# EasyEDA schematic SCH_MSP430G2553-protoboard.json
TITLE: MSP430 Proto Board; REV: 4.0; Date: 2021-03-15; Sheet: 1/1; Drawn By: Richard Spagnola; Company: Your Company
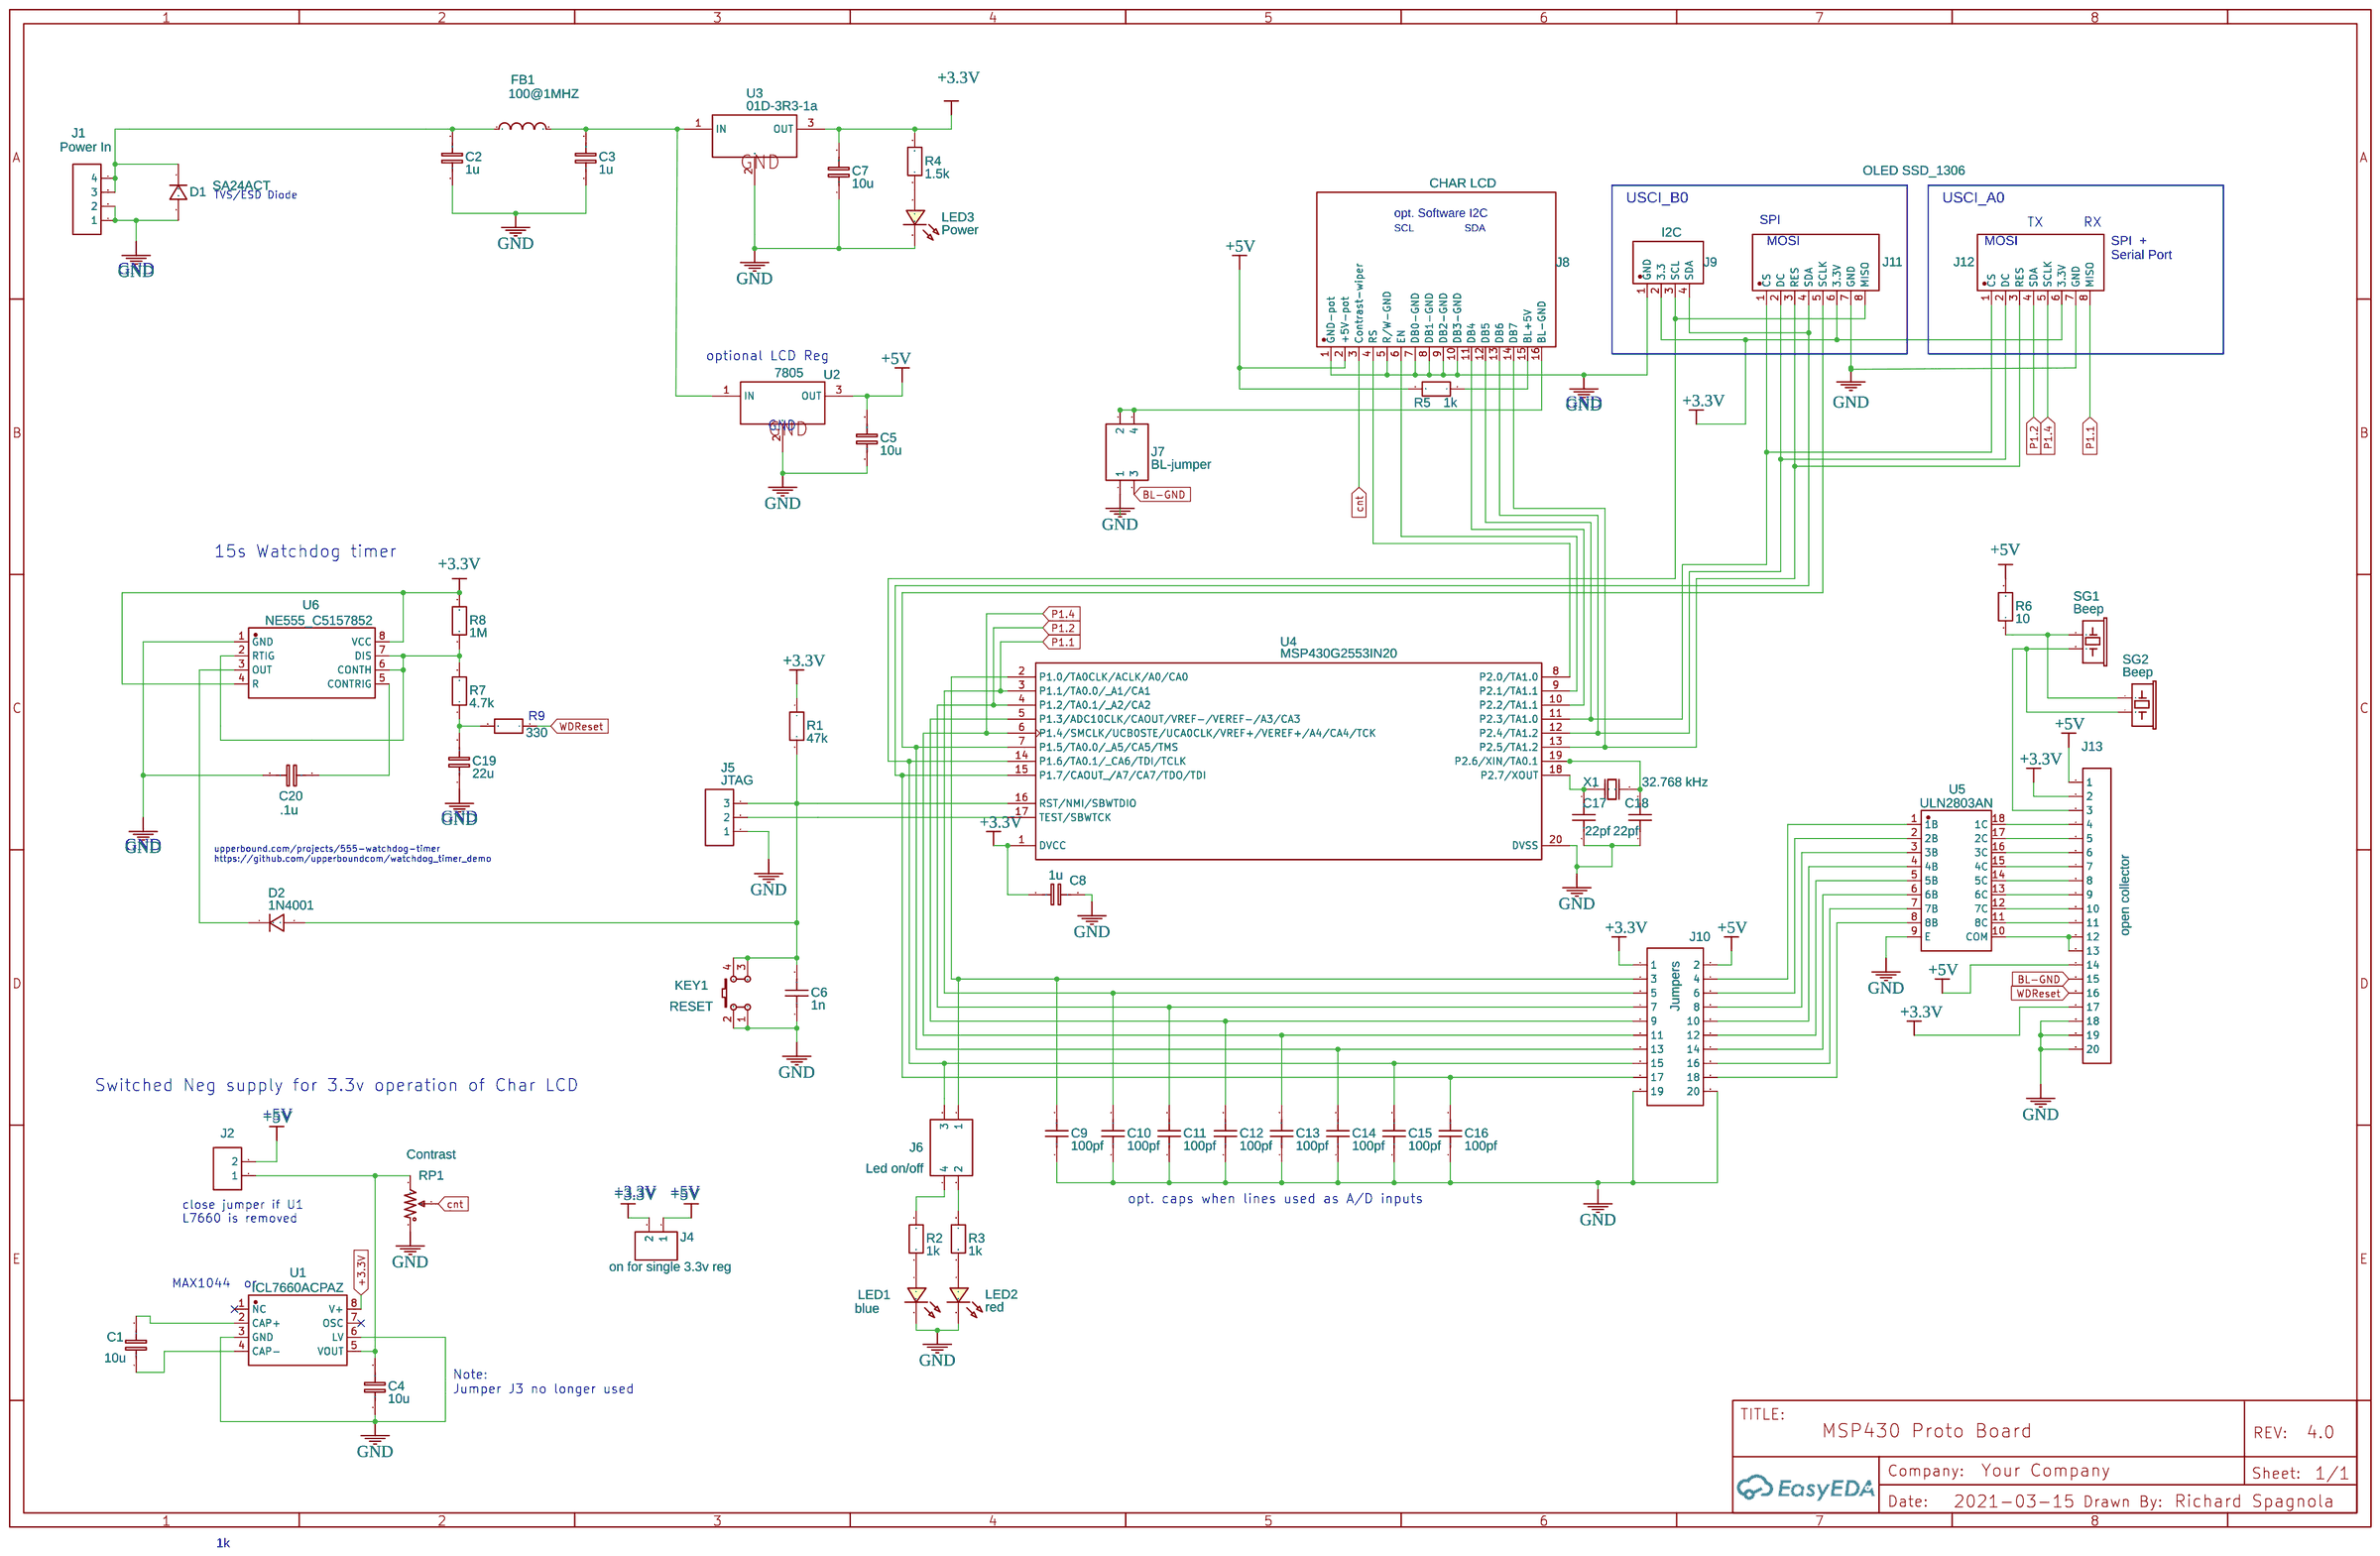
[diagram p0: schematic sheet]

## Parts
C1  10u  [RAD-0.2]
C2  1u  [RAD-0.2]
C3  1u  [RAD-0.2]
C4  10u  [RAD-0.2]
C5  10u  [RAD-0.2]
C6  1n  [RAD-0.1]
C7  10u  [RAD-0.2]
C8  1u  [RAD-0.2]
C9  100pf  [RAD-0.1]
C10  100pf  [RAD-0.1]
C11  100pf  [RAD-0.1]
C12  100pf  [RAD-0.1]
C13  100pf  [RAD-0.1]
C14  100pf  [RAD-0.1]
C15  100pf  [RAD-0.1]
C16  100pf  [RAD-0.1]
C17  22pf  [RAD-0.1]
C18  22pf  [RAD-0.1]
C19  22u  [RAD-0.2]
C20  .1u  [RAD-0.2]
D1  SA24ACT  [DO-41_BD2.4-L4.7-P8.70-D0.9-RD]
D2  1N4001  [DO-41_BD2.4-L4.7-P8.70-D0.9-RD]
FB1  100@1MHZ  [BEAD-TH_MLB6-10-3T-F]
J1  Power In  [HDR-M-2.54_1X4]
J2  HDR-M-2.54_1x2  [HDR-M-2.54_1X2]
J4  on for single 3.3v reg  [HDR-M-2.54_1X2]
J5  JTAG  [HDR-M-2.54_1X3]
J6  Led on/off  [HDR-M-2.54_2X2]
J7  BL-jumper  [HDR-M-2.54_2X2]
J8  CHAR LCD  [HDR-M-2.54_1X16]
J9  I2C  [HDR-M-2.54_1X4]
J10  Jumpers  [HDR-M-2.54_2X10]
J11  OLED SSD_1306  [HDR-M-2.54_1X8]
J12  OLED SSD_1306  [HDR-M-2.54_1X8]
J13  open collector  [HDR-M-2.54_1X20]
KEY1  RESET  [KEY-TH_4P-L6.0-W6.0-P4.50-LS6.5]
LED1  blue  [LED-TH_BD3.0_BLUE]
LED2  red  [LED-TH_BD3.0_RED]
LED3  Power  [LED-TH_BD3.0_GREEN]
R1  47k  [R_AXIAL-0.4]
R2  1k  [R_AXIAL-0.4]
R3  1k  [R_AXIAL-0.4]
R4  1.5k  [R_AXIAL-0.4]
R5  1k  [R_AXIAL-0.4]
R6  10  [R_AXIAL-0.4]
R7  4.7k  [R_AXIAL-0.4]
R8  1M  [R_AXIAL-0.4]
R10  330  [R_AXIAL-0.4]
RP1  Contrast  [RES-ADJ-TH_3386P]
SG1  Beep  [BEEP-TH_BD16.0-P5.00-D0.6-L-FD]
SG2  Beep  [BUZZER-12MM]
U1  ICL7660ACPAZ  [PDIP-8_L9.6-W6.4-P2.54-LS7.6-BL]
U2  7805  [TO-220-3_L10.0-W4.5-P2.54-L]
U3  01D-3R3-1a  [TO-220-3_L10.0-W4.5-P2.54-L]
U4  MSP430G2553IN20  [DIP-20_L25.5-W10.0-P2.54-LS7.6-BL]
U5  ULN2803AN  [DIP-18_L23.0-W6.5-P2.54-LS7.6-BL]
U6  NE555_C5157852  [DIP-8_L9.8-W6.4-P2.54-LS7.6-BL]
X1  32.768 kHz  [HC-49US_L11.5-W4.5-P4.88]

## Library data of the parts
C1-C5 C7 C8 C19 C20 = C_RAD-0.2_EU: Contributor: LCEDA_Lib
C6 C9-C18 = C_RAD-0.1_US: Contributor: LCEDA_Lib; Package Display: No
D1 D2 = 1N4007: Supplier: LCSC; Manufacturer: SEMTECH; Supplier Part: C106903; Contributor: LCEDA_Lib
FB1 = 6Hole beads6*10-3T: Supplier: LCSC; Manufacturer: Meled(美莱); Manufacturer Part: MLB6*10-3T(f); Supplier Part: C59501; JLCPCB Part Class: Extended Part; Package Display: No
J1 = HDR-M-2.54_1x4: Supplier Part: C124378; Supplier: LCSC; Contributor: LCEDA_Lib; Package Display: No
J2 J4 = HDR-M-2.54_1x2: Supplier Part: C124375; Supplier: LCSC; Contributor: LCEDA_Lib
J5 = HDR-M-2.54_1x3: Supplier Part: C180248; Supplier: LCSC; Contributor: LCEDA_Lib; Package Display: No
J6 J7 = HDR-M-2.54_2x2: Supplier Part: C66690; Supplier: LCSC; Contributor: LCEDA_Lib
J8 = LCD: Package Display: No
J9 = I2C: Package Display: No
J10 = HDR-M-2.54_2x10: Supplier Part: C124359; Supplier: LCSC; Contributor: LCEDA_Lib; Package Display: No
J11 J12 = SSD_1306: Package Display: No
J13 = HDR-M-2.54_1x20: Supplier Part: C50981; Supplier: LCSC; Contributor: LCEDA_Lib; Package Display: No
KEY1 = K4-6×6_TH: Supplier: LCSC; Supplier Part: C136684; Manufacturer: 韩国韩荣; Manufacturer Part: K2-1102DP-E4SW-04; Contributor: LCEDA_Lib; Package Display: No
LED1 = LED-TH-5mm_B: Supplier: LCSC; Contributor: LCEDA_Lib; Package Display: No
LED2 = LED-TH-5mm_R: Manufacturer: EVERLIGHT(台湾亿光); Manufacturer Part: 333-2SURD/S530-A3; Supplier Part: C87271; Supplier: LCSC; Contributor: LCEDA_Lib; Package Display: No
LED3 = LED-TH-5mm_G: Manufacturer: EVERLIGHT(台湾亿光); Manufacturer Part: 333-2SYGD/S530-E2; Supplier Part: C88163; Supplier: LCSC; Contributor: LCEDA_Lib; Package Display: No
R1 = R_AXIAL-0.3_EU: Contributor: LCEDA_Lib; Package Display: No
R2 R3 R5-R8 R10 = R_AXIAL-0.4_EU: Contributor: LCEDA_Lib; Package Display: No
R4 = R_AXIAL-0.5_EU: Contributor: LCEDA_Lib; Package Display: No
RP1 = R_3386P_US: Supplier: LCSC; Contributor: LCEDA_Lib; value(Ω): 5K; Package Display: No
SG1 SG2 = BUZZER: Contributor: SparkFun; Package Display: No
U1 = ICL7660ACPAZ: Supplier: LCSC; Supplier Part: C1356059; Manufacturer: RENESAS(瑞萨)/IDT; Contributor: LCSC
U2 U3 = 7805(TO-220): Supplier: LCSC; Manufacturer: STMicroelectronics; Manufacturer Part: L7805CV-DG; Supplier Part: C3795; Contributor: LCEDA_Lib; Package Display: No
U4 = MSP430G2553IN20: Supplier: LCSC; Supplier Part: C201660; Manufacturer: Texas Instruments; Contributor: LCSC; LCSC Assembly: Yes; SMT Type: Extend
U5 = ULN2803AN: Supplier: LCSC; Supplier Part: C481685; Manufacturer: HTC Korea TAEJIN Tech; Contributor: LCSC
U6 = NE555_C5157852: Supplier: LCSC; Supplier Part: C5157852; Manufacturer: Gcore(扬州国芯); Manufacturer Part: NE555; Contributor: lcsc
X1 = ESA16.0000F12M25F: Supplier: LCSC; Supplier Part: C353692; Manufacturer: ZHUHAI MONEC ELEC; Contributor: LCSC; LCSC Assembly: Yes; SMT Type: Extend; Assembly Type: manualWeld; Paste Type: expand

## Nets
+3.3V: C7.2 C8.1 J4.2 J9.2(3.3) J10.1 J11.6(3.3V) J12.6(3.3V) J13.2 J13.17 R1.1 R4.2 R8.2 U1.8(V+) U3.3(OUT) U4.1(DVCC) U6.4(R) U6.8(VCC)
+5V: C5.2 J2.2 J4.1 J8.2(+5V-pot) J10.2 J13.1 J13.14 R5.2 R6.2 U2.3(OUT)
GND: C2.1 C3.1 C4.1 C5.1 C6.1 C7.1 C8.2 C9.1 C10.1 C11.1 C12.1 C13.1 C14.1 C15.1 C16.1 C17.2 C18.1 C19.1 C20.2 D1.2 J1.1 J1.2 J5.1 J7.1 J8.1(GND-pot) J8.5(R/W-GND) J8.7(DB0-GND) J8.8(DB1-GND) J8.9(DB2-GND) J8.10(DB3-GND) J9.1(GND) J10.19 J10.20 J11.7(GND) J12.7(GND) J13.18 J13.19 J13.20 KEY1.1 KEY1.2 LED1.2 LED2.2 LED3.2 RP1.1 U1.3(GND) U1.6(LV) U2.2(GND) U3.2(GND) U4.20(DVSS) U5.9(E) U6.1(GND)
BL-GND: J7.3 J13.15
cnt: J8.3(Contrast-wiper) RP1.2
P1.1: C10.2 J10.5 J12.8(MISO) U4.3(P1.1/TA0.0/ A1/CA1)
P1.2: C11.2 J10.7 J12.4(SDA) U4.4(P1.2/TA0.1/ A2/CA2)
P1.4: C13.2 J10.11 J12.5(SCLK) U4.6(P1.4/SMCLK/UCB0STE/UCA0CLK/VREF+/VEREF+/A4/CA4/TCK)
WDReset: J13.16 R10.1
Net-(C1-1): C1.1 U1.4(CAP-)
Net-(C1-2): C1.2 U1.2(CAP+)
Net-(C2-2): C2.2 D1.1 FB1.1 J1.3 J1.4
Net-(C3-2): C3.2 FB1.2 U2.1(IN) U3.1(IN)
Net-(C4-2): C4.2 J2.1 RP1.3 U1.5(VOUT)
Net-(C6-2): C6.2 D2.2 J5.3 KEY1.3 KEY1.4 R1.2 U4.16(RST/NMI/SBWTDIO)
Net-(C9-2): C9.2 J6.1 J10.3 U4.2(P1.0/TA0CLK/ACLK/A0/CA0)
Net-(C12-2): C12.2 J10.9 U4.5(P1.3/ADC10CLK/CAOUT/VREF-/VEREF-/A3/CA3)
Net-(C14-2): C14.2 J10.13 J11.5(SCLK) U4.7(P1.5/TA0.0/ A5/CA5/TMS)
Net-(C15-2): C15.2 J6.3 J9.3(SCL) J10.15 J11.8(MISO) U4.14(P1.6/TA0.1/ CA6/TDI/TCLK)
Net-(C16-2): C16.2 J9.4(SDA) J10.17 J11.4(SDA) U4.15(P1.7/CAOUT /A7/CA7/TDO/TDI)
Net-(C17-1): C17.1 U4.18(P2.7/XOUT) X1.1(OSC1)
Net-(C18-2): C18.2 U4.19(P2.6/XIN/TA0.1) X1.2(OSC2)
Net-(C19-2): C19.2 R7.1 R10.2
Net-(C20-1): C20.1 U6.5(CONTRIG)
Net-(D2-1): D2.1 U6.3(OUT)
Net-(J5-2): J5.2 U4.17(TEST/SBWTCK)
Net-(J6-2): J6.2 R3.2
Net-(J6-4): J6.4 R2.2
Net-(J7-2): J7.2 J7.4 J8.16(BL-GND)
Net-(J8-4): J8.4(RS) U4.8(P2.0/TA1.0)
Net-(J8-6): J8.6(EN) U4.9(P2.1/TA1.1)
Net-(J8-11): J8.11(DB4) U4.10(P2.2/TA1.1)
Net-(J8-12): J8.12(DB5) J11.1(CS) J12.1(CS) U4.11(P2.3/TA1.0)
Net-(J8-13): J8.13(DB6) J11.2(DC) J12.2(DC) U4.12(P2.4/TA1.2)
Net-(J8-14): J8.14(DB7) J11.3(RES) J12.3(RES) U4.13(P2.5/TA1.2)
Net-(J8-15): J8.15(BL+5V) R5.1
Net-(J10-4): J10.4 U5.1(1B)
Net-(J10-6): J10.6 U5.2(2B)
Net-(J10-8): J10.8 U5.3(3B)
Net-(J10-10): J10.10 U5.4(4B)
Net-(J10-12): J10.12 U5.5(5B)
Net-(J10-14): J10.14 U5.6(6B)
Net-(J10-16): J10.16 U5.7(7B)
Net-(J10-18): J10.18 U5.8(8B)
Net-(J13-3): J13.3 SG1.2 SG2.-(2)
Net-(J13-4): J13.4 U5.18(1C)
Net-(J13-5): J13.5 U5.17(2C)
Net-(J13-6): J13.6 U5.16(3C)
Net-(J13-7): J13.7 U5.15(4C)
Net-(J13-8): J13.8 U5.14(5C)
Net-(J13-9): J13.9 U5.13(6C)
Net-(J13-10): J13.10 U5.12(7C)
Net-(J13-11): J13.11 U5.11(8C)
Net-(J13-12): J13.12 J13.13 U5.10(COM)
Net-(LED1-1): LED1.1 R2.1
Net-(LED2-1): LED2.1 R3.1
Net-(LED3-1): LED3.1 R4.1
Net-(R6-1): R6.1 SG1.1 SG2.+(1)
Net-(R7-2): R7.2 R8.1 U6.2(RTIG) U6.6(CONTH) U6.7(DIS)

Not connected (* = marked no-connect by the designer): U1 1(NC)* 7(OSC)*

## Notes on the sheet
- TVS/ESD Diode
- USCI_B0
- USCI_A0
- opt. Software I2C
- SCL
- SDA
- SPI
- TX
- RX
- MOSI
- MOSI
- SPI  +
- GND
- Serial Port
- optional LCD Reg
- GND
- GND
- 15s Watchdog timer
- R9
- GND
- GND
- upperbound.com/projects/555-watchdog-timer
  https://github.com/upperboundcom/watchdog_timer_demo
- Switched Neg supply for 3.3v operation of Char LCD
- +5V
- +3.3V
- +5V
- opt. caps when lines used as A/D inputs
- close jumper if U1
  L7660 is removed
- MAX1044  or
- Note:
  Jumper J3 no longer used
- 1k
